# Altium project 16f877a Developer Board.PrjPcb (part 2 of 2)

## Sheet Sheet14.SchDoc
size A4; SheetNumber: 3; SheetTotal: 3
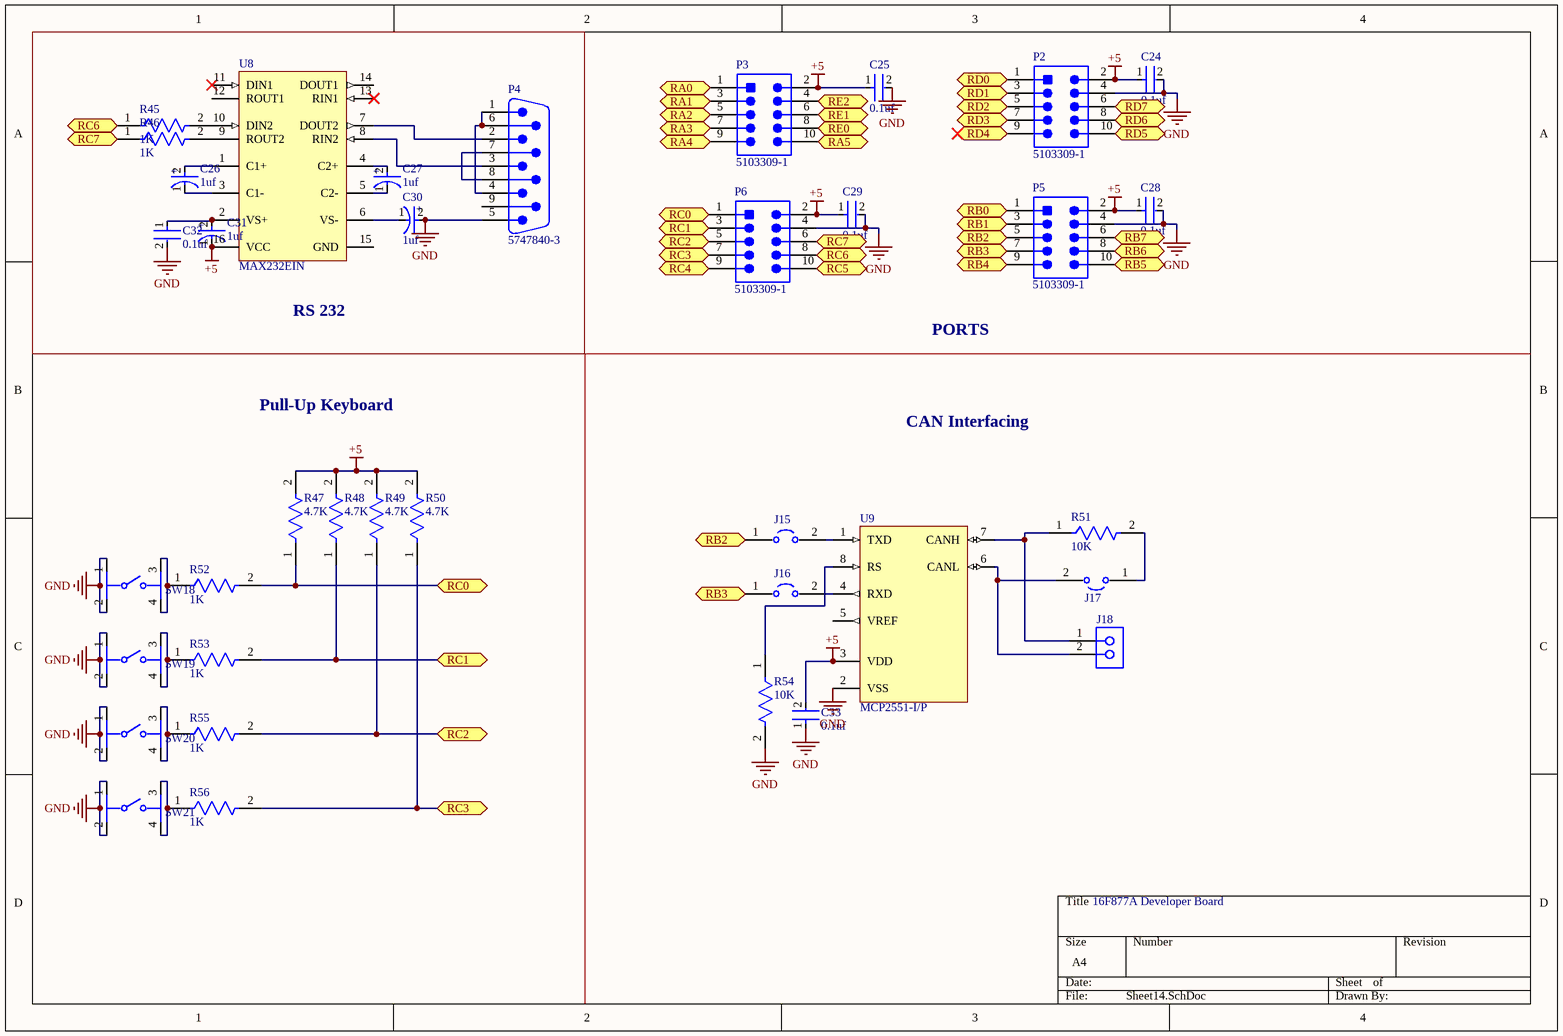
[diagram p2: Sheet14.SchDoc]

### Parts
C24  0.1uf  [FP-C1206C-EB-MFG]
C25  0.1uf  [FP-C1206C-EB-MFG]
C26  1uf  [FP-RAD-TH-D_5_0_5-L_11_1-MFG]
C27  1uf  [FP-RAD-TH-D_5_0_5-L_11_1-MFG]
C28  0.1uf  [FP-C1206C-EB-MFG]
C29  0.1uf  [FP-C1206C-EB-MFG]
C30  1uf  [FP-RAD-TH-D_5_0_5-L_11_1-MFG]
C31  1uf  [FP-RAD-TH-D_5_0_5-L_11_1-MFG]
C32  0.1uf  [FP-C1206C-EB-MFG]
C33  0.1uf  [FP-C1206C-EB-MFG]
J15  S1911-46R  [FP-S1911-46R-MFG]  (value not drawn)
J16  S1911-46R  [FP-S1911-46R-MFG]  (value not drawn)
J17  S1911-46R  [FP-S1911-46R-MFG]  (value not drawn)
J18  691307300002  [691307300002]  (value not drawn)
P2  5103309-1  [TECO-5103309-1_V]
P3  5103309-1  [TECO-5103309-1_V]
P4  5747840-3  [TECO-5747840-3_V]
P5  5103309-1  [TECO-5103309-1_V]
P6  5103309-1  [TECO-5103309-1_V]
R45  1K  [FP-RQ732B-IPC_C]
R46  1K  [FP-RQ732B-IPC_C]
R47  4.7K  [FP-RCMM02-MFG]
R48  4.7K  [FP-RCMM02-MFG]
R49  4.7K  [FP-RCMM02-MFG]
R50  4.7K  [FP-RCMM02-MFG]
R51  10K  [FP-CF18-MFG]
R52  1K  [FP-RQ732B-IPC_C]
R53  1K  [FP-RQ732B-IPC_C]
R54  10K  [FP-CF18-MFG]
R55  1K  [FP-RQ732B-IPC_C]
R56  1K  [FP-RQ732B-IPC_C]
SW18  TL3305AF260QG  [FP-TL3305AF260QG-MFG]  (value not drawn)
SW19  TL3305AF260QG  [FP-TL3305AF260QG-MFG]  (value not drawn)
SW20  TL3305AF260QG  [FP-TL3305AF260QG-MFG]  (value not drawn)
SW21  TL3305AF260QG  [FP-TL3305AF260QG-MFG]  (value not drawn)
U8  MAX232EIN  [N0016A]
U9  MCP2551-I/P  [PDIP300-P8]

### Blocks framed on the sheet
RS 232: C26 C27 C30-C32 P4 R45 R46 U8

### Ports
RA0 (bidir, see Sheet11[3A], Sheet12[2B]), RA1 (bidir, see Sheet11[3A], Sheet12[2B]), RA2 (bidir, see Sheet11[3A], Sheet12[2B]), RA3 (bidir, see Sheet11[3A], Sheet12[2A]), RA4 (bidir, see Sheet11[3A]), RA5 (bidir, see Sheet11[1A], Sheet11[3A]), RB0 (bidir, see Sheet11[1D], Sheet11[3A], Sheet12[1A], Sheet12[4D]), RB1 (bidir, see Sheet11[3A], Sheet11[4A], Sheet12[2C]), RB2 (bidir, see Sheet11[3A], Sheet12[2C], Sheet14[2C]), RB2 (bidir, see Sheet11[3A], Sheet12[2C], Sheet14[3A]), RB3 (bidir, see Sheet11[3A], Sheet12[2D], Sheet14[2C]), RB3 (bidir, see Sheet11[3A], Sheet12[2D], Sheet14[3A]), RB4 (bidir, see Sheet11[3A], Sheet12[2D]), RB5 (bidir, see Sheet11[3B], Sheet12[2C]), RB6 (bidir, see Sheet11[3B], Sheet12[2C], Sheet12[3C], Sheet12[3D]), RB7 (bidir, see Sheet11[3B], Sheet12[2C], Sheet12[3C], Sheet12[3D]), RC0 (bidir, see Sheet11[3B], Sheet11[3C], Sheet14[2A]), RC0 (bidir, see Sheet11[3B], Sheet11[3C], Sheet14[2C]), RC1 (bidir, see Sheet11[3B], Sheet11[3C], Sheet14[2A]), RC1 (bidir, see Sheet11[3B], Sheet11[3C], Sheet14[2C]), RC2 (bidir, see Sheet11[1D], Sheet11[3B], Sheet11[3C], Sheet14[2A]), RC2 (bidir, see Sheet11[1D], Sheet11[3B], Sheet11[3C], Sheet14[2C]), RC3 (bidir, see Sheet11[4A], Sheet14[2A]), RC3 (bidir, see Sheet11[4A], Sheet14[2D]), RC4 (bidir, see Sheet11[3A], Sheet11[3B]), RC5 (bidir, see Sheet11[3B]), RC6 (bidir, see Sheet11[3B], Sheet14[1A]), RC6 (bidir, see Sheet11[3B], Sheet14[3A]), RC7 (bidir, see Sheet11[3B], Sheet14[1A]), RC7 (bidir, see Sheet11[3B], Sheet14[3A]), RD0 (bidir, see Sheet11[2B], Sheet11[3C], Sheet12[2A]), RD1 (bidir, see Sheet11[2B], Sheet11[3C], Sheet12[2A]), RD2 (bidir, see Sheet11[2B], Sheet11[3D], Sheet12[2A]), RD3 (bidir, see Sheet11[2B], Sheet11[3D], Sheet12[2A]), RD4 (bidir, see Sheet11[2B], Sheet11[3D], Sheet12[2A]), RD5 (bidir, see Sheet11[2B], Sheet11[3D], Sheet12[2A]), RD6 (bidir, see Sheet11[2B], Sheet11[3D], Sheet12[2A]), RD7 (bidir, see Sheet11[2B], Sheet11[3D], Sheet12[2A]), RE0 (bidir, see Sheet11[2B]), RE1 (bidir, see Sheet11[1B], Sheet11[2B]), RE2 (bidir, see Sheet11[2B])

### Nets
+5: C24.1 C25.1 C28.1 C29.1 C31.1(C) C33.2 P2.2 P3.2 P5.2 P6.2 R47.2 R48.2 R49.2 R50.2 U8.16(VCC) U9.3(VDD)
GND: C24.2 C25.2 C28.2 C29.2 C30.2(A) C32.2 C33.1 P2.4 P4.5 P5.4 P6.4 R54.2 SW18.1 SW18.2 SW19.1 SW19.2 SW20.1 SW20.2 SW21.1 SW21.2 U9.2(VSS)
NetC26_1: C26.1(C) U8.3(C1-)
NetC26_2: C26.2(A) U8.1(C1+)
NetC27_1: C27.1(C) U8.5(C2-)
NetC27_2: C27.2(A) U8.4(C2+)
NetC30_1: C30.1(C) U8.6(VS-)
NetC31_2: C31.2(A) C32.1 U8.2(VS+)
NetJ1_2: P3.10 ; port RA5
NetJ2_1: P6.7 R50.1 R56.2 ; port RC3
NetJ2_2: P5.3 ; port RB1
NetJ3_1: P6.9 ; port RC4
NetJ3_2: P5.1 ; port RB0
NetJ5_2: P3.6 ; port RE1
NetJ14_4: P5.6 ; port RB7
NetJ14_5: P5.8 ; port RB6
NetJ15_1: J15.1 P5.5 ; port RB2
NetJ15_2: J15.2 U9.1(TXD)
NetJ16_1: J16.1 P5.7 ; port RB3
NetJ16_2: J16.2 U9.4(RXD)
NetJ17_1: J17.1 R51.2
NetJ17_2: J17.2 J18.2 U9.6(CANL)
NetJ18_1: J18.1 R51.1 U9.7(CANH)
NetP2_1: P2.1 ; port RD0
NetP2_3: P2.3 ; port RD1
NetP2_5: P2.5 ; port RD2
NetP2_6: P2.6 ; port RD7
NetP2_7: P2.7 ; port RD3
NetP2_8: P2.8 ; port RD6
NetP2_9: P2.9 ; port RD4
NetP2_10: P2.10 ; port RD5
NetP3_1: P3.1 ; port RA0
NetP3_3: P3.3 ; port RA1
NetP3_4: P3.4 ; port RE2
NetP3_5: P3.5 ; port RA2
NetP3_7: P3.7 ; port RA3
NetP3_8: P3.8 ; port RE0
NetP3_9: P3.9 ; port RA4
NetP4_1: P4.1 P4.4 P4.6
NetP4_2: P4.2 U8.7(DOUT2)
NetP4_3: P4.3 U8.8(RIN2)
NetP4_7: P4.7 P4.8
NetP5_9: P5.9 ; port RB4
NetP5_10: P5.10 ; port RB5
NetP6_1: P6.1 R47.1 R52.2 ; port RC0
NetP6_3: P6.3 R48.1 R53.2 ; port RC1
NetP6_5: P6.5 R49.1 R55.2 ; port RC2
NetP6_6: P6.6 R46.1 ; port RC7
NetP6_8: P6.8 R45.1 ; port RC6
NetP6_10: P6.10 ; port RC5
NetR45_2: R45.2 U8.10(DIN2)
NetR46_2: R46.2 U8.9(ROUT2)
NetR52_1: R52.1 SW18.3 SW18.4
NetR53_1: R53.1 SW19.3 SW19.4
NetR54_1: R54.1 U9.8(RS)
NetR55_1: R55.1 SW20.3 SW20.4
NetR56_1: R56.1 SW21.3 SW21.4

Not connected (* = marked no-connect by the designer): P4 9; U8 11(DIN1)* 12(ROUT1) 13(RIN1)* 14(DOUT1) 15(GND); U9 5(VREF)

### Notes on the sheet
- PORTS
- Pull-Up Keyboard
- CAN Interfacing
- 16F877A Developer Board
- (in symbol CMP-05427-001266-1) +

### Library data of the parts
C24 C25 C28 C29 C32 C33 = CMP-03020-018297-1: C1206 0.10 μF U2J 20.00% 50 V; Manufacturer: KEMET; Manufacturer Part Number: C1206C104M5JACAUTO; Voltage Rating: 50 V; Automotive Grade: Grade 0; Capacitance: 0.10 μF; Value: 0.10 μF; Temperature Coefficient: 15%; Tolerance: 0.2; Material: Ceramic; Height: 0.88mm; Lead Free: Yes; ComponentLink2Description: Datasheet; ComponentLink2URL: https://content.kemet.com/datasheets/KEM_C1007_X8R_ULTRA_150C_SMD.pdf; Ipc Land Pattern Name: CAPC320160X78; Temperature Characteristic: U2J; RoHS: TRUE; Octopart: https://octopart.com/c1206c104m5jacauto-kemet-84732526; Package: C1206C-EB; Temperature Range Low: -55°C; Automotive: Yes; Temperature Range High: +150°C; Category: Cap; Device Class L3: Ceramic Capacitors; Device Class L2: Capacitors; Temperature: -55°C to +150°C; Device Class L1: Passive Components
C26 C27 C30 C31 = CMP-05427-001266-1: Aluminum Electrolytic Capacitors (Radial Lead Type) 1uF ±20% 50V; Ripple Current: 8mA; Life (Hours): 5000Hour; Lead Diameter: 0.5mm; Min Operating Temperature: -40°C; Series: EB; Mount: Through Hole; Max Operating Temperature: 105°C; Lead Pitch: 5mm; Height: 11mm; Voltage Rating: 50V; Voltage Rating (DC): 50V; Case/Package: Radial; Package Quantity: 2000; Termination: Radial; Capacitance: 1uF; Diameter: 5mm; Height - Seated (Max): 0.472inch; Length: 11mm; Tolerance: 20%; Packaging: Tape and Reel; RoHS Compliant: Yes; Radiation Hardening: No
J15-J17 = CMP-15817-000009-1: JUMPER TIN SMD; Gender: Non-Gendered; Current Rating: 10A; Number of Contacts: 2; Pitch: 0.119inch; Material: Brass; REACH SVHC: No SVHC; Number of Rows: 1; Plating: Tin; Contact Plating: Tin; Length: 6.85mm; RoHS Compliant: Yes; Height: 0.038inch; Packaging: Tape and Reel; Contact Material: Brass; Orientation: Straight; Termination: SMD/SMT; Depth: 2.51mm; Color: Silver; Number of Positions: 2; Series: S1; Package Quantity: 4000
J18 = CMP-1502-01831-3: Terminal Block, Socket, 2Pos, Th Rohs Compliant: Yes; Number of Positions Per Level: 2; Number of Levels: 1; Voltage: 300V; Current: 8A; Pitch: 3.81mm; Gender: Female; Lead Pitch: 3.81mm; RoHS: Compliant; Contact Plating: Tin; Mount: Through Hole; Number of Positions: 2; Packaging: Box; Min Operating Temperature: -40°C; Max Operating Temperature: 115°C; Number of Pins: 2; Termination: Solder; Orientation: Vertical; Color: Green
P2 P3 P5 P6 = CMP-2000-07502-1: Male Header, Pitch 2.54 mm, 2 x 5 Position, Height 9.855 mm, Tail Length 3.048 mm, -65 to 105 degC, RoHS, Tube; Manufacturer: TE Connectivity; PCB Mounting Orientation: Vertical; Pitch: 2.54mm; Mating Connector Lock: No(Without); Body Material: Thermoplastic; Shrouded: Yes(With); Connector System: Wire-to-Board; Insulation Resistance: 5GR; Number of Positions: 10; Max Current Rating: 1A; PCB Mount Retention: Without; Manufacturer URL: http://www.te.com/; Contact Plating: Gold; Datasheet URL: http://www.te.com/commerce/DocumentDelivery/DDEController?Action=showdoc&DocId=Customer+Drawing%7F5103309%7FE1%7Fpdf%7FEnglish%7FENG_CD_5103309_E1.pdf%7F5103309-1; Colour: Black; Termination: ThroughHole; Housing Colour: Black; Flammability Rating: UL94V-0; Package Description: Male Header, Pitch 2.54 mm, 2 x 5 Position, Height 9.855 mm, Tail Length 3.048 mm; Mating Retention: No(Without); Orientation: Straight; Row Spacing: 2.54mm; Termination Post Length: 0.12inch; Min Operating Temperature: -65degC; Board Standoff: Yes(With); REACH SVHC: NoSVHC; Depth: 9.14mm; Lead Free: LeadFree; Gender: Male; Connector Type: Header; Shrouded End Dimension: 3.81mm; ELV: Compliant; Mating Alignment: Yes(With); Panel Mount Retention: No(Without); Package Quantity: 35; PCB Mount Alignment: No(Without); Number of Rows: 2; Package Reference: 5103309-1; Mounting Technology: ThroughHole; Mount: ThroughHole; Contact Gender: Male; Number of Contacts: 10; Length: 0.8inch; Current Rating: 1A; Contact Mating Length: 0.24inch; Max Operating Temperature: 105degC; RoHSCompliant: True; Datasheet Version: Rev. E1, 03/2011; Contact Shape: Square; Height: 8.813mm; Housing Material: PBT; Contact Material: CopperAlloy; Packaging: Rail/Tube
P4 = CMP-2000-05647-1: Male D-Sub Connector, Pitch 2.74 mm, 2 Row, 9 Position, Height 12.93 mm, Tail Length 3.17 mm, -55 to 105 degC, RoHS, Tray; Manufacturer: TE Connectivity; Current Rating: 6A; Flange Feature: Housing/Shell(4-40); Catalog Drawings: AMPD-SubMale.318; Dynamic Catalog: AMPLIMITEHD-20Series; Number of Positions: 9; Voltage Rating: 125V; Other Names: A32091; Mating Products: 5-747905-7-ND / -CONND-SUBRCPT9POSVERTSLD / 5-787355-1-ND / -CONNRCPT9POSVERTSOLDERCUP / 5746861-4-ND / -CONNRECEPT9POSGOLDIDC / A32510-ND / -CONND-SUBRCPT9POSSLDCUPAU / AFL09B-ND / -CONND-SUBRECEPT9POS30GOLD / A31975-ND / -CONND-SUBRECEPT9P22-26AWGAU / A31974-ND / -CONND-SUBRECEPT9P20-22AWGAU / A31973-ND / -CONND-SUBRECEPT9P26-30AWGAU / A31931-ND / -CONND-SUBRCPT9POS22-26AWGAU; 3D Model: 5747840-3.pdf; Connector Type: Plug,MalePins; Product Training Modules: AMPLIMITED-SubConnectors; Featured Product: AMPLIMITED-SubminiatureConnectors; Contact Finish Thickness: Flash; Operating Temperature: -55°C~105°C; Shell Material, Finish: Steel,TinPlated; Datasheet URL: http://www.te.com/commerce/DocumentDelivery/DDEController?Action=srchrtrv&DocNm=5747840&DocType=Customer+Drawing&DocLang=English; Shell Size, Connector Layout: 1(DE,E); Package Description: Male D-Sub Connector, Pitch 2.74 mm, 2 Row, 9 Position, Height 12.93 mm, Tail Length 3.17 mm; Package Reference: 5747840-3; Mounting Technology: ThroughHole; Contact Type: Signal; Standard Package: 130; Family: D-SubConnectors; Manufacturer URL: http://www.te.com/; Contact Finish: Gold; Category: Connectors,Interconnects; RoHS Information: 5747840-3StatementofCompliance; Color: Black; Number of Rows: 2; Connector Style: D-Sub; Series: AMPLIMITEHD-20; Mounting Type: ThroughHole,RightAngle; Features: BoardLock,GroundStrap,GroundingIndents; Datasheet Version: Rev. D, 01/2013; Termination: Solder
R45 R46 R52 R53 R55 R56 = CMP-03211-006012-1: RQ732B 1206 1KΩ 0.4W 10ppm/°C 0.1% 200V; Manufacturer: TE; Manufacturer Part Number: RQ73C2B1K0BTDF; Automotive Grade: Grade 0; ComponentLink2URL: https://www.te.com/commerce/DocumentDelivery/DDEController?Action=showdoc&DocId=Data+Sheet%7F1773270-2%7FA%7Fpdf%7FEnglish%7FENG_DS_1773270-2_A.pdf%7F9-2176388-1149; Device Class L2: Resistors; Tolerance: 0.1%; Temperature Coefficient: 10ppm/°C; Resistance: 1KΩ; Value: 1KΩ; Temperature Range High: +155°C; Temperature Range Low: -55°C; Package: RQ732B; Composition: Thin Film; Lead Free: Yes; Power Rating: 0.4W; Voltage Rating: 200V; RoHS: TRUE; Device Class L1: Passive Components; Device Class L3: Chip SMD Resistors; Octopart: https://octopart.com/rq73c2b1k0btdf-te+connectivity-99292457; Category: Res; Automotive: Yes; Ipc Land Pattern Name: RESC310160X60; Height: 0.75mm; Temperature: -55°C to +155°C; ComponentLink2Description: Datasheet; Series: RQ73
R47-R50 = CMP-02408-000034-1: RES 4.7K OHM 2% 1/2W AXIAL; Temperature Coefficient: 100ppm/°C; Resistance: 4.7kR; RoHS Compliant: Yes; Contact Plating: Tin; Tolerance: 2%; Diameter: 2.5mm; Case/Package: Molded; Length: 6.5mm; Mount: Through Hole; Resistor Type: Metal Film
R51 R54 = CMP-26528-000002-1: RES 10K OHM 1/8W 5% CF AXIAL; Manufacturer Part Number: CF18JT10K0; Manufacturer: Stackpole Electronics; Power Rating: 0.125W; Temperature Coefficient: 0-500ppm/°C; Resistance: 10kΩ; Voltage Rating: 250V; Value: 10kΩ; Temperature: -55°C to +155°C; Height: 2mm; Lead Free: Yes; Automotive: No; Device Class L2: Resistors; Package: CF18; Series: CF; ComponentLink2Description: Datasheet; Ipc Land Pattern Name: RESAD656W65L360D200; Temperature Range High: +155°C; RoHS: TRUE; Device Class L3: Through-Hole Resistors; Temperature Range Low: -55°C; Device Class L1: Passive Components; Category: Res; Octopart: https://octopart.com/cf18jt10k0-stackpole+electronics-19205642; Composition: Carbon Film; Digikey Description: RES 10K OHM 1/8W 5% CF AXIAL; ComponentLink2URL: http://www.seielect.com/Catalog/SEI-CF_CFM.pdf; Tolerance: 5%
SW18-SW21 = CMP-17879-000010-1: SWITCH TACTILE SPST-NO 50MA 12V; Mechanical Life: 200000Cycles; Switch Function: Off-Mom; Actuator Type: Standard; Operating Force: 260gf; Illumination Type: Non-Illuminated; Switch Travel: 0.2mm; Throw Configuration: SPST; Min Operating Temperature: -20°C; Max Operating Temperature: 70°C; Lead Free: Lead Free; Mount: Surface Mount; Packaging: Tape and Reel; Termination: Gull Wing
U8 = CMP-0299-00016-2: Dual RS-232 Driver / Receiver with IEC61000-4-2 Protection, -40 to 85 degC, 16-Pin PDIP (N),  Pb-Free (RoHS); ICC(Max)(mA): 10; Drivers Per Package: 2; IEC-61000-4-2 SUPPORT: TRUE; ESD HBM(kV): +/-15; Supply Voltage(s)(V): 5; SubFamily: RS-232; PackageDescription: 16-Pin Plastic Dual-In-Line Package, Row Spacing 7.62 mm, Pitch 2.54 mm; ComponentLink2URL: http://www.ti.com/general/docs/lit/getliterature.tsp?genericPartNumber=MAX232E&fileType=pdf; ComponentLink3URL: http://www.ti.com/litv/pdf/mpdi002c; DatasheetVersion: SLLS723B; ComponentLink2Description: Datasheet; PackageReference: N0016A; PackageVersion: revE, Dec-2002; ComponentLink1Description: Manufacturer URL; Single Supply: TRUE; Receivers Per Package: 2; RS-232: TRUE; ComponentLink3Description: Package Specification; ComponentLink1URL: www.ti.com
U9 = CMP-0186-00101-2: High-Speed CAN Transceiver, 8-Pin PDIP, Industrial Temperature; PackageDescription: 8-Lead Plastic Dual In-Line (P) - 300 mil Body [PDIP]; Code_JEDEC: MS-001; ComponentLink1Description: Manufacturer URL; DatasheetVersion: revF, Jul-2010; PackageReference: PDIP300-P8; ComponentLink3Description: Package Specification; ComponentLink3URL: http://www.microchip.com/stellent/groups/techpub_sg/documents/packagingspec/en012702.pdf; ComponentLink2URL: http://ww1.microchip.com/downloads/en/DeviceDoc/21667F.pdf; ComponentLink1URL: http://www.microchip.com/; RevisionNote: URLs added. DatasheetVersion updated.; PackageVersion: revBB, Aug-2009; ComponentLink2Description: Datasheet

## Nets that join several sheets
+5: Sheet11 (14 pins), Sheet12 (5 pins), Sheet14 (16 pins)
GND: Sheet11 (33 pins), Sheet12 (26 pins), Sheet14 (21 pins)
NetC3_1: Sheet11 (5 pins), Sheet12 (J14.1 P1.1)
NetJ1_2: Sheet11 (J1.2 U1.7), Sheet14 (P3.10)
NetJ2_1: Sheet11 (J2.1 J4.1 U1.18), Sheet14 (P6.7 R50.1 R56.2)
NetJ2_2: Sheet11 (J2.2 R17.2 U1.34 U5.6), Sheet12 (R40.2 U7.6), Sheet14 (P5.3)
NetJ3_1: Sheet11 (5 pins), Sheet12 (U7.5), Sheet14 (P6.9)
NetJ3_2: Sheet11 (J3.2 J11.1 U1.33), Sheet12 (J13.1 R44.2), Sheet14 (P5.1)
NetJ5_2: Sheet11 (J5.2 U1.9), Sheet14 (P3.6)
NetJ14_4: Sheet11 (U1.40), Sheet12 (J14.4 P1.4 R39.2), Sheet14 (P5.6)
NetJ14_5: Sheet11 (U1.39), Sheet12 (J14.5 P1.5), Sheet14 (P5.8)
NetJ14_6: Sheet11 (R4.2 R5.2), Sheet12 (J14.6 P1.6)
NetJ15_1: Sheet11 (U1.35), Sheet12 (R41.2), Sheet14 (J15.1 P5.5)
NetJ16_1: Sheet11 (R4.1 U1.36), Sheet12 (R42.2), Sheet14 (J16.1 P5.7)
NetP2_1: Sheet11 (U1.19), Sheet14 (P2.1)
NetP2_3: Sheet11 (SW3.2 U1.20), Sheet14 (P2.3)
NetP2_5: Sheet11 (U1.21), Sheet14 (P2.5)
NetP2_6: Sheet11 (U1.30), Sheet14 (P2.6)
NetP2_7: Sheet11 (SW3.4 U1.22), Sheet14 (P2.7)
NetP2_8: Sheet11 (U1.29), Sheet14 (P2.8)
NetP2_9: Sheet11 (U1.27), Sheet12 (R19.1), Sheet14 (P2.9)
NetP2_10: Sheet11 (SW3.6 U1.28), Sheet14 (P2.10)
NetP3_1: Sheet11 (U1.2), Sheet12 (R32.1), Sheet14 (P3.1)
NetP3_3: Sheet11 (U1.3), Sheet12 (R31.1), Sheet14 (P3.3)
NetP3_4: Sheet11 (U1.10), Sheet14 (P3.4)
NetP3_5: Sheet11 (U1.4), Sheet12 (R30.1), Sheet14 (P3.5)
NetP3_7: Sheet11 (U1.5), Sheet12 (R29.1), Sheet14 (P3.7)
NetP3_8: Sheet11 (R9.2 U1.8), Sheet14 (P3.8)
NetP3_9: Sheet11 (U1.6), Sheet14 (P3.9)
NetP5_9: Sheet11 (U1.37), Sheet12 (R43.2), Sheet14 (P5.9)
NetP5_10: Sheet11 (R5.1 U1.38), Sheet12 (R37.2), Sheet14 (P5.10)
NetP6_1: Sheet11 (SW2.2 U1.15), Sheet14 (P6.1 R47.1 R52.2)
NetP6_3: Sheet11 (SW2.3 U1.16), Sheet14 (P6.3 R48.1 R53.2)
NetP6_5: Sheet11 (R18.1 SW2.4 U1.17), Sheet14 (P6.5 R49.1 R55.2)
NetP6_6: Sheet11 (U1.26), Sheet14 (P6.6 R46.1)
NetP6_8: Sheet11 (U1.25), Sheet14 (P6.8 R45.1)
NetP6_10: Sheet11 (R10.1 U1.24), Sheet14 (P6.10)